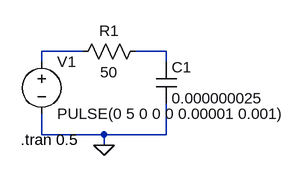
[diagram p0: schematic RC_Circuit.asc]
RC_Circuit.asc, the LTspice schematic file:
Version 4
SHEET 1 880 680
WIRE 96 -240 32 -240
WIRE 224 -240 176 -240
WIRE 32 -224 32 -240
WIRE 224 -224 224 -240
WIRE 32 -112 32 -144
WIRE 128 -112 32 -112
WIRE 224 -112 224 -160
WIRE 224 -112 128 -112
WIRE 128 -96 128 -112
FLAG 128 -96 0
SYMBOL res 192 -256 R90
WINDOW 0 0 56 VBottom 2
WINDOW 3 32 56 VTop 2
SYMATTR InstName R1
SYMATTR Value 50
SYMBOL cap 208 -224 R0
SYMATTR InstName C1
SYMATTR Value 0.000000025
SYMBOL voltage 32 -240 R0
WINDOW 123 0 0 Left 0
WINDOW 39 0 0 Left 0
SYMATTR InstName V1
SYMATTR Value PULSE(0 5 0 0 0 0.00001 0.001)
TEXT 0 -104 Left 2 !.tran 0.5

The netlist it stands for:
* RC_Circuit.asc
R1 N002 N001 50
C1 N002 0 0.000000025
V1 N001 0 PULSE(0 5 0 0 0 0.00001 0.001)
.tran 0.5
.backanno
.end